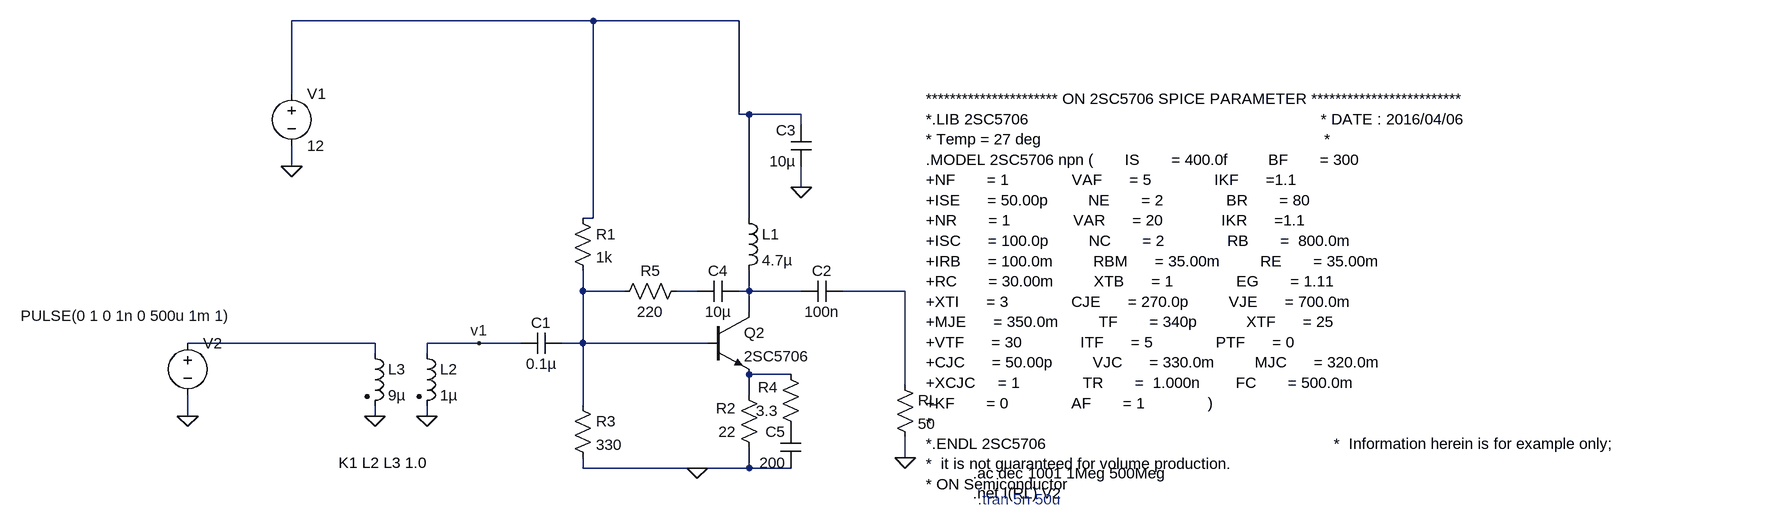
[diagram p0: schematic 2sc5706.asc]
2sc5706.asc, the LTspice schematic file:
Version 4
SHEET 1 2420 840
WIRE 144 16 -320 16
WIRE 368 16 144 16
WIRE -320 128 -320 16
WIRE 368 160 368 16
WIRE 384 160 368 160
WIRE 464 160 384 160
WIRE 464 176 464 160
WIRE -320 240 -320 208
WIRE 464 272 464 240
WIRE 144 320 144 16
WIRE 144 320 128 320
WIRE 384 320 384 160
WIRE 128 432 128 400
WIRE 192 432 128 432
WIRE 304 432 272 432
WIRE 384 432 384 400
WIRE 384 432 368 432
WIRE 464 432 384 432
WIRE 624 432 528 432
WIRE 384 464 384 432
WIRE -192 512 -480 512
WIRE -32 512 -112 512
WIRE 32 512 -32 512
WIRE 128 512 128 432
WIRE 128 512 96 512
WIRE 320 512 128 512
WIRE -192 528 -192 512
WIRE -112 528 -112 512
WIRE 448 560 384 560
WIRE 624 576 624 432
WIRE 384 592 384 560
WIRE 128 608 128 512
WIRE -480 624 -480 592
WIRE -192 624 -192 608
WIRE -112 624 -112 608
WIRE 624 688 624 656
WIRE 128 704 128 688
WIRE 304 704 128 704
WIRE 384 704 384 672
WIRE 384 704 304 704
WIRE 448 704 384 704
FLAG -320 240 0
FLAG 304 704 0
FLAG 624 688 0
FLAG -480 624 0
FLAG 464 272 0
FLAG -192 624 0
FLAG -112 624 0
FLAG -32 512 v1
DATAFLAG 160 512 "$"
DATAFLAG 384 576 "$"
SYMBOL npn 320 464 R0
SYMATTR InstName Q2
SYMATTR Value 2SC5706
SYMBOL res 112 304 R0
SYMATTR InstName R1
SYMATTR Value 1k
SYMBOL voltage -320 112 R0
SYMATTR InstName V1
SYMATTR Value 12
SYMBOL ind 368 304 R0
SYMATTR InstName L1
SYMATTR Value 4.7µ
SYMBOL cap 96 496 R90
WINDOW 0 0 32 VBottom 2
WINDOW 3 32 32 VTop 2
SYMATTR InstName C1
SYMATTR Value 0.1µ
SYMBOL cap 528 416 R90
WINDOW 0 0 32 VBottom 2
WINDOW 3 32 32 VTop 2
SYMATTR InstName C2
SYMATTR Value 100n
SYMBOL res 608 560 R0
SYMATTR InstName RL
SYMATTR Value 50
SYMBOL voltage -480 496 R0
WINDOW 3 -257 -26 Left 2
SYMATTR Value PULSE(0 1 0 1n 0 500u 1m 1)
SYMATTR InstName V2
SYMATTR Value2 AC 1
SYMATTR SpiceLine Rser=50
SYMBOL cap 480 240 R180
WINDOW 0 24 56 Left 2
WINDOW 3 24 8 Left 2
SYMATTR InstName C3
SYMATTR Value 10µ
SYMBOL ind2 -128 512 R0
SYMATTR InstName L2
SYMATTR Value 1µ
SYMATTR Type ind
SYMBOL ind2 -208 512 R0
SYMATTR InstName L3
SYMATTR Value 9µ
SYMATTR Type ind
SYMBOL res 400 688 R180
WINDOW 0 36 76 Left 2
WINDOW 3 36 40 Left 2
SYMATTR InstName R2
SYMATTR Value 22
SYMBOL res 112 592 R0
SYMATTR InstName R3
SYMATTR Value 330
SYMBOL res 288 416 R90
WINDOW 0 0 56 VBottom 2
WINDOW 3 32 56 VTop 2
SYMATTR InstName R5
SYMATTR Value 220
SYMBOL cap 368 416 R90
WINDOW 0 0 32 VBottom 2
WINDOW 3 32 32 VTop 2
SYMATTR InstName C4
SYMATTR Value 10µ
SYMBOL res 464 656 R180
WINDOW 0 36 76 Left 2
WINDOW 3 36 40 Left 2
SYMATTR InstName R4
SYMATTR Value 3.3
SYMBOL cap 464 704 R180
WINDOW 0 24 56 Left 2
WINDOW 3 24 8 Left 2
SYMATTR InstName C5
SYMATTR Value 200
TEXT 728 712 Left 2 !.ac dec 1001 1Meg 500Meg\n.net I(RL) V2
TEXT 736 752 Left 2 ;.tran 5n 50u
TEXT -248 696 Left 2 !K1 L2 L3 1.0
TEXT 656 136 Left 2 !********************** ON 2SC5706 SPICE PARAMETER *************************\n*.LIB 2SC5706                                                                 * DATE : 2016/04/06                                                           \n* Temp = 27 deg                                                               *                                                                             \n.MODEL 2SC5706 npn (       IS       = 400.0f         BF       = 300           \n+NF       = 1              VAF      = 5              IKF      =1.1            \n+ISE      = 50.00p         NE       = 2              BR       = 80            \n+NR       = 1              VAR      = 20             IKR      =1.1            \n+ISC      = 100.0p         NC       = 2              RB       =  800.0m       \n+IRB      = 100.0m         RBM      = 35.00m         RE       = 35.00m        \n+RC       = 30.00m         XTB      = 1              EG       = 1.11          \n+XTI      = 3              CJE      = 270.0p         VJE      = 700.0m        \n+MJE      = 350.0m         TF       = 340p           XTF      = 25            \n+VTF      = 30             ITF      = 5              PTF      = 0             \n+CJC      = 50.00p         VJC      = 330.0m         MJC      = 320.0m        \n+XCJC     = 1              TR       =  1.000n        FC       = 500.0m        \n+KF       = 0              AF       = 1              )                        \n*                                                                             \n*.ENDL 2SC5706                                                                *  Information herein is for example only;                                    \n*  it is not guaranteed for volume production.                                \n* ON Semiconductor

The netlist it stands for:
* 2sc5706.asc
Q2 N004 N002 N007 0 2SC5706
R1 N001 N002 1k
V1 N001 0 12
L1 N001 N004 4.7µ
C1 N002 v1 0.1µ
C2 N005 N004 100n
RL N005 0 50
V2 N006 0 PULSE(0 1 0 1n 0 500u 1m 1) AC 1 Rser=50
C3 0 N001 10µ
L2 v1 0 1µ
L3 N006 0 9µ
R2 0 N007 22
R3 N002 0 330
R5 N003 N002 220
C4 N004 N003 10µ
R4 P001 N007 3.3
C5 0 P001 200
.model NPN NPN
.model PNP PNP
.lib standard.bjt
.ac dec 1001 1Meg 500Meg
.net I(RL) V2
* .tran 5n 50u
K1 L2 L3 1.0
********************** ON 2SC5706 SPICE PARAMETER *************************
*.LIB 2SC5706                                                                 * DATE : 2016/04/06
* Temp = 27 deg                                                               *
.MODEL 2SC5706 npn (       IS       = 400.0f         BF       = 300
+NF       = 1              VAF      = 5              IKF      =1.1
+ISE      = 50.00p         NE       = 2              BR       = 80
+NR       = 1              VAR      = 20             IKR      =1.1
+ISC      = 100.0p         NC       = 2              RB       =  800.0m
+IRB      = 100.0m         RBM      = 35.00m         RE       = 35.00m
+RC       = 30.00m         XTB      = 1              EG       = 1.11
+XTI      = 3              CJE      = 270.0p         VJE      = 700.0m
+MJE      = 350.0m         TF       = 340p           XTF      = 25
+VTF      = 30             ITF      = 5              PTF      = 0
+CJC      = 50.00p         VJC      = 330.0m         MJC      = 320.0m
+XCJC     = 1              TR       =  1.000n        FC       = 500.0m
+KF       = 0              AF       = 1              )
*
*.ENDL 2SC5706                                                                *  Information herein is for example only;
*  it is not guaranteed for volume production.
* ON Semiconductor
.backanno
.end